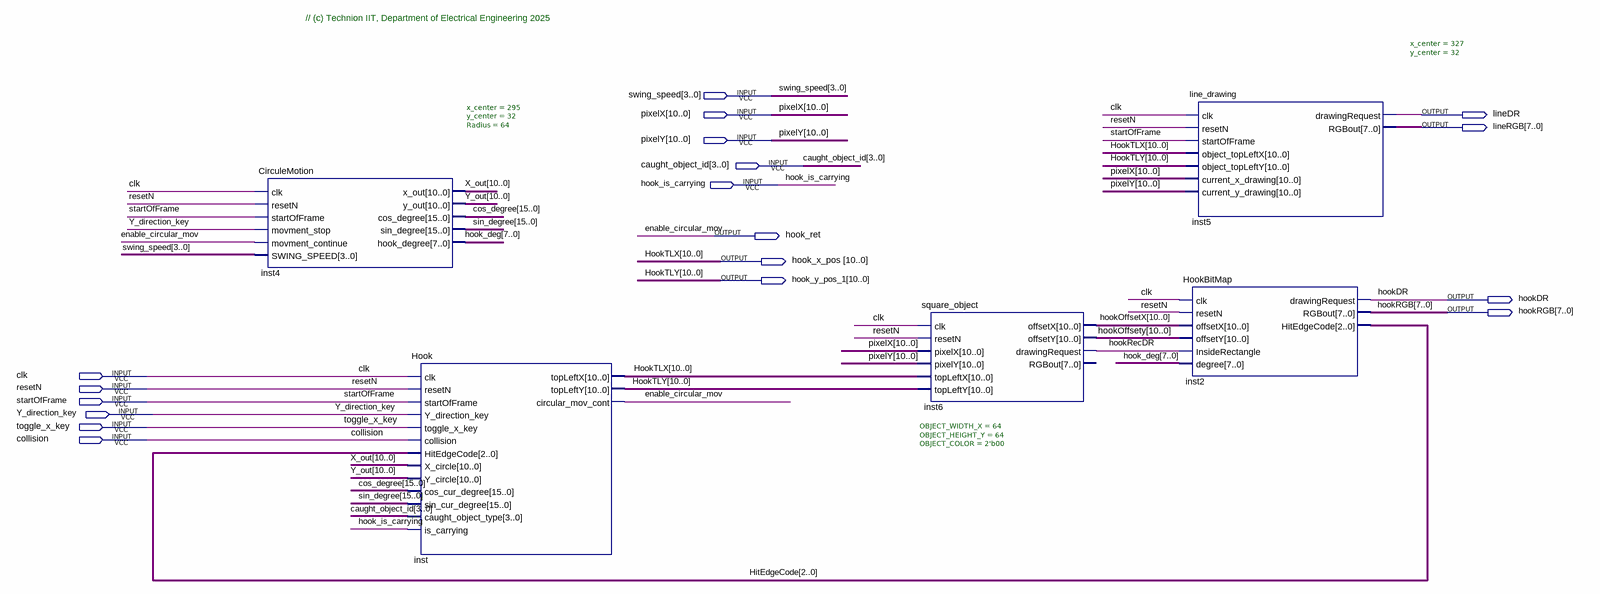
[diagram p0: schematic sheet]
// Quartus schematic Hook_Block_T.bdf as structural Verilog: 5 symbols, 18 pins
module Hook_Block_T (
  input  [3:0] swing_speed,
  input  [10:0] pixelX,
  input  [10:0] pixelY,
  input  [3:0] caught_object_id,
  input  hook_is_carrying,
  input  clk,
  input  resetN,
  input  startOfFrame,
  input  Y_direction_key,
  input  toggle_x_key,
  input  collision,
  output lineDR,
  output [7:0] lineRGB,
  output hook_ret,
  output [10:0] hook_x_pos,
  output [10:0] hook_y_pos_1,
  output hookDR,
  output [7:0] hookRGB
);

  wire hookRecDR;
  wire [2:0] HitEdgeCode;
  wire [7:0] hook_deg;
  wire [10:0] hookOffsetX, hookOffsety, X_out, Y_out;
  wire [15:0] cos_degree, sin_degree;

  CirculeMotion #(.x_center(295), .y_center(32), .Radius(64)) inst4 (
    .clk(clk), .resetN(resetN), .startOfFrame(startOfFrame), .movment_stop(Y_direction_key),
    .movment_continue(hook_ret), .SWING_SPEED(swing_speed), .x_out(X_out), .y_out(Y_out),
    .cos_degree(cos_degree), .sin_degree(sin_degree), .hook_degree(hook_deg));
  Hook inst (
    .clk(clk), .resetN(resetN), .startOfFrame(startOfFrame), .Y_direction_key(Y_direction_key),
    .toggle_x_key(toggle_x_key), .collision(collision), .HitEdgeCode(HitEdgeCode), .X_circle(X_out),
    .Y_circle(Y_out), .cos_cur_degree(cos_degree), .sin_cur_degree(sin_degree),
    .caught_object_type(caught_object_id), .is_carrying(hook_is_carrying), .topLeftX(hook_x_pos),
    .topLeftY(hook_y_pos_1), .circular_mov_cont(hook_ret));
  square_object #(.OBJECT_WIDTH_X(64), .OBJECT_HEIGHT_Y(64), .OBJECT_COLOR(2'b00)) inst6 (
    .clk(clk), .resetN(resetN), .pixelX(pixelX), .pixelY(pixelY), .topLeftX(hook_x_pos),
    .topLeftY(hook_y_pos_1), .offsetX(hookOffsetX), .offsetY(hookOffsety), .drawingRequest(hookRecDR));  // open: RGBout
  line_drawing #(.x_center(327), .y_center(32)) inst5 (
    .clk(clk), .resetN(resetN), .startOfFrame(startOfFrame), .object_topLeftX(hook_x_pos),
    .object_topLeftY(hook_y_pos_1), .current_x_drawing(pixelX), .current_y_drawing(pixelY),
    .drawingRequest(lineDR), .RGBout(lineRGB));
  HookBitMap inst2 (
    .clk(clk), .resetN(resetN), .offsetX(hookOffsetX), .offsetY(hookOffsety), .InsideRectangle(hookRecDR),
    .degree(hook_deg), .drawingRequest(hookDR), .RGBout(hookRGB), .HitEdgeCode(HitEdgeCode));

  // Other names for the same wires on the sheet: enable_circular_mov = hook_ret; HookTLX[10:0] = hook_x_pos;
  //   HookTLY[10:0] = hook_y_pos_1

  // Notes on the sheet:
  //   // (c) Technion IIT, Department of Electrical Engineering 2025
endmodule
